# EAGLE design XOrduino2 (EAGLE 6.2)
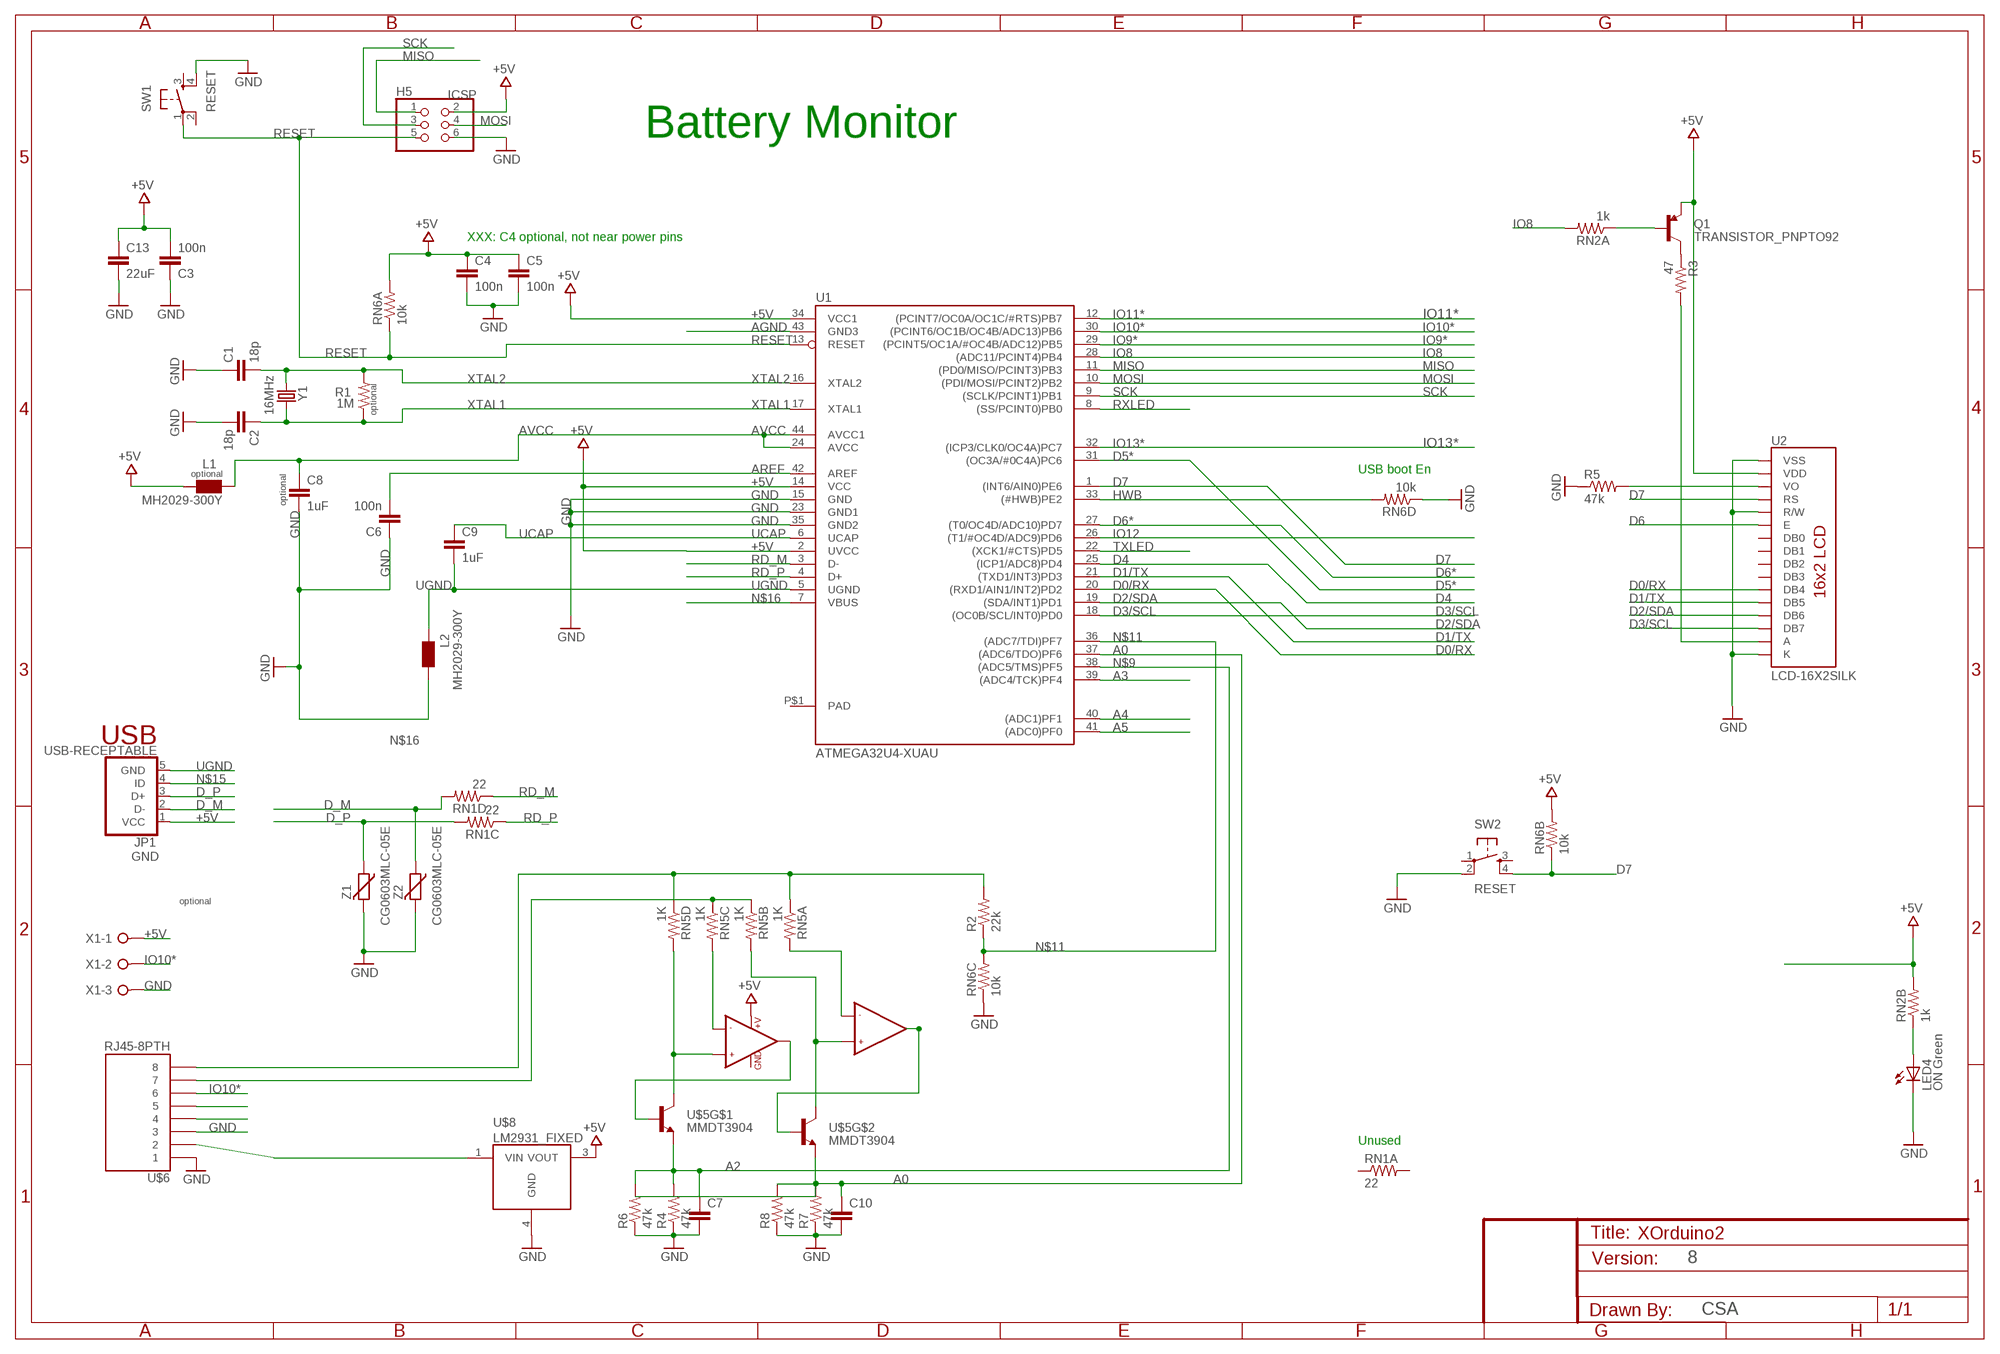
[diagram p0: schematic, sheet 1]

## Parts
C1  18p  CAP0805  [0805]
C2  18p  CAP0805  [0805]
C3  100n  CAP0805  [0805]
C4  100n  CAP0805  [0805]
C5  100n  CAP0805  [0805]
C6  100n  CAP0805  [0805]
C7  CAP0805  [0805]
C8  1uF  CAP0805  [0805]
C9  1uF  CAP0805  [0805]
C10  CAP0805  [0805]
C13  22uF  CAP1206  [1206]
H5  ICSP  PINHD-2X3  [2X03]
JP1  USB-RECEPTABLE  [FCI-10103594-0001LF]
L1  MH2029-300Y  WE-CBF_0805  [0805]
L2  MH2029-300Y  WE-CBF_0805  [0805]
LED4  ON Green  LED0805  [LED0805]
Q1  TRANSISTOR_PNPTO92  [TO-92]
R1  1M  RESISTOR0805-RES  [0805]
R2  22k  RESISTOR0805-RES  [0805]
R3  47  R-US_0207/15  [0207/15]
R4  47k  RESISTOR0805-RES  [0805]
R5  47k  RESISTOR0805-RES  [0805]
R6  47k  RESISTOR0805-RES  [0805]
R7  47k  RESISTOR0805-RES  [0805]
R8  47k  RESISTOR0805-RES  [0805]
RN1  22  RESISTOR-ARRAYCRA06S  [CRA06S]
RN2  1k  RESISTOR-ARRAYCRA06S  [CRA06S]
RN5  1K  RESISTOR-ARRAYCRA06S  [CRA06S]
RN6  10k  RESISTOR-ARRAYCRA06S  [CRA06S]
SW1  RESET  TAC_SWITCHPTH  [TACTILE-PTH]
SW2  RESET  TAC_SWITCHPTH  [TACTILE-PTH]
U1  ATMEGA32U4-XUAU  [TQFP44-PAD]
U2  LCD-16X2SILK  [LCD-16X2]
U$2  LMV358  [SO08]
U$5  MMDT3904  [SOT363]
U$6  RJ45-8PTH  [RJ45-8]
U$8  LM2931_FIXED  [DPAK]
X1  W237-03P  [W237-133]
Y1  16MHz  CRYSTALHC49US  [HC49US]
Z1  CG0603MLC-05E  VARISTORCN0603  [CT/CN0603]
Z2  CG0603MLC-05E  VARISTORCN0603  [CT/CN0603]

## Nets
+5V [power]: C3.2 C4.1 C5.1 C13.1 H5.2 JP1.1(VCC) L1.1 Q1.1(E) RN2.7 RN6.7 RN6.8 U1.2(UVCC) U1.14(VCC) U1.34(VCC1) U2.2(VDD) U$2.8(+V) U$8.3(VOUT) X1.1
A0: C10.1 R7.2 R8.2 U1.37((ADC6/TDO)PF6) U$5.1(E)
A2: C7.1 R4.2 R6.2 U$5.4(E)
A3: U1.39((ADC4/TCK)PF4)
A4: U1.40((ADC1)PF1)
A5: U1.41((ADC0)PF0)
AGND: U1.43(GND3)
AREF [aref]: C6.2 U1.42(AREF)
AVCC: C8.1 L1.2 U1.24(AVCC) U1.44(AVCC1)
D0/RX: U1.20((RXD1/AIN1/INT2)PD2) U2.11(DB4)
D1/TX: U1.21((TXD1/INT3)PD3) U2.12(DB5)
D2/SDA: U1.19((SDA/INT1)PD1) U2.13(DB6)
D3/SCL: U1.18((OC0B/SCL/INT0)PD0) U2.14(DB7)
D4: U1.25((ICP1/ADC8)PD4)
D5*: U1.31((OC3A/#0C4A)PC6)
D6: U2.6(E)
D6*: U1.27((T0/OC4D/ADC10)PD7)
D7: RN6.2 SW2.4 U1.1((INT6/AIN0)PE6) U2.4(RS)
D_M: JP1.2(D-) RN1.5 Z2.1
D_P: JP1.3(D+) RN1.6 Z1.1
GND [gnd]: C1.1 C2.2 C3.1 C4.2 C5.2 C6.1 C7.2 C8.2 C10.2 C13.2 H5.6 L2.2 LED4.C R4.1 R5.1 R6.1 R7.1 R8.1 RN6.3 RN6.4 SW1.4 SW2.2 U1.15(GND) U1.23(GND1) U1.35(GND2) U2.1(VSS) U2.5(R/W) U2.16(K) U$6.1 U$6.3 U$6.4 U$8.4(GND) X1.3 Z1.2 Z2.2
HWB: RN6.5 U1.33((#HWB)PE2)
IO8: RN2.8 U1.28((ADC11/PCINT4)PB4)
IO9*: U1.29((PCINT5/OC1A/#OC4B/ADC12)PB5)
IO10*: U1.30((PCINT6/OC1B/OC4B/ADC13)PB6) U$6.6 X1.2
IO11*: U1.12((PCINT7/OC0A/OC1C/#RTS)PB7)
IO12: U1.26((T1/#OC4D/ADC9)PD6)
IO13*: U1.32((ICP3/CLK0/OC4A)PC7)
LED4_ANODE: LED4.A RN2.2
MISO: H5.1 U1.11((PD0/MISO/PCINT3)PB3)
MOSI: H5.4 U1.10((PDI/MOSI/PCINT2)PB2)
N$1: RN5.5 U$2.3(+IN1) U$5.3(C)
N$2: RN5.8 U$2.6(-IN2)
N$3: RN5.7 U$2.5(+IN2) U$5.6(C)
N$4: U$2.1(OUT1) U$5.5(B)
N$5: U$2.7(OUT2) U$5.2(B)
N$6: RN5.6 U$2.2(-IN1)
N$7: R2.2 RN5.1 RN5.4 U$6.8
N$8: RN5.2 RN5.3 U$6.7
N$9: U1.38((ADC5/TMS)PF5)
N$10: Q1.3(C) R3.1
N$11: R2.1 RN6.6 U1.36((ADC7/TDI)PF7)
N$12: R5.2 U2.3(VO)
N$13: R3.2 U2.15(A)
N$15: JP1.4(ID)
N$16 [power]: U1.7(VBUS)
N$18: U$6.2 U$8.1(VIN)
N$19: Q1.2(B) RN2.1
N$20: U$6.5
RD_M: RN1.4 U1.3(D-)
RD_P: RN1.3 U1.4(D+)
RESET: H5.5 RN6.1 SW1.1 U1.13(RESET)
RXLED: U1.8((SS/PCINT0)PB0)
SCK: H5.3 U1.9((SCLK/PCINT1)PB1)
TXLED: U1.22((XCK1/#CTS)PD5)
UCAP: C9.1 U1.6(UCAP)
UGND [gnd]: C9.2 JP1.5(GND) L2.1 U1.5(UGND)
XTAL1: C2.1 R1.1 U1.17(XTAL1) Y1.2
XTAL2: C1.2 R1.2 U1.16(XTAL2) Y1.1
Unconnected: RN1.1 RN1.2 RN1.7 RN1.8 RN2.3 RN2.4 RN2.5 RN2.6 SW1.2 SW1.3 SW2.1 SW2.3 U2.7(DB0) U2.8(DB1) U2.9(DB2) U2.10(DB3)

## Notes on the sheet
- Battery Monitor
- XXX: C4 optional, not near power pins
- optional
- USB boot En
- optional
- optional
- USB
- optional
- Unused
- 8
- CSA

## Power pins joined to a net without a drawn wire
GND: U$2.4(GND)
PAD: U1.P$1(PAD)

## Library data of the parts
C1-C6 C8 C9 C13 = SparkFun-Passives:CAP: Capacitor Standard 0603 ceramic capacitor, and 0.1" leaded capacitor.
C7 C10 = SparkFun-Capacitors:CAP: Capacitor Standard 0603 ceramic capacitor, and 0.1" leaded capacitor.
H5 = SmartPrj:PINHD-2X3: PIN HEADER
JP1 = daspilker:USB-RECEPTABLE: USB Receptable
L1 L2 = wuerth-elektronik:WE-CBF: SMD EMI Suppression Ferrite Beads - excellent anti-EMI properties - low DCR - impedances till 3000 ohms - rated current up to 6 A
LED4 = xorduino:LED
Q1 = SparkFun-DiscreteSemi:TRANSISTOR_PNP: Generic PNP BJT. Double check pinouts against datasheets- not all devices are the same!
R1 R2 R4-R8 = SparkFun-Passives:RESISTOR: Resistor Basic schematic elements and footprints for 0603, 1206, and PTH resistors.
R3 = adafruit:R-US_: RESISTOR, American symbol
RN1 RN2 RN5 RN6 = xorduino:RESISTOR-ARRAY
SW1 SW2 = SparkFun-Electromechanical:TAC_SWITCH: Momentary Switch Button commonly used for reset or general input. Spark Fun Electronics SKU : COM-00097
U1 = SmartPrj:ATMEGA32U4-XU
U2 = SparkFun-Displays:LCD-16X2: Standard text-only 16x2 parallel input LCD
U$2 = SparkFun-AnalogIC:LMV358: Jellybean rail-to-rail output op-amp
U$5 = SparkFun-DiscreteSemi:MMDT3904: Dual NPN transistor
U$6 = SparkFun-Connectors:RJ45-8: RJ45 Jack Simple RJ45, 8-pin connection - connector for common Cat5, Cat5e, and Cat6 Ethernet cables. Footprint not yet proven in production. Connector sku is PRT-00643; Breakout PCB sku is BOB-00716.
U$8 = SparkFun-PowerIC:LM2931_FIXED: LDO regulator with reverse battery protection- very durable!
X1 = con-wago-508:W237-03P: WAGO SREW CLAMP; OC_FARNELL: unknown; OC_NEWARK: unknown
Y1 = SparkFun-FreqCtrl:CRYSTAL: Various standard crystals. Proven footprints. Spark Fun Electronics SKU : COM-00534
Z1 Z2 = varistor:VARISTOR: VARISTOR

## Net classes
0 default: width 0.203 mm, drill 0.406 mm, clearance 0.203 mm
1 power: width 0.203 mm, drill 0.406 mm, clearance 0.203 mm
2 gnd: width 0.203 mm, drill 0.406 mm, clearance 0.203 mm
3 usbvcc: width 0.203 mm, drill 0.406 mm, clearance 0.203 mm
4 aref: width 0.203 mm, drill 0.406 mm, clearance 0.203 mm

## Board
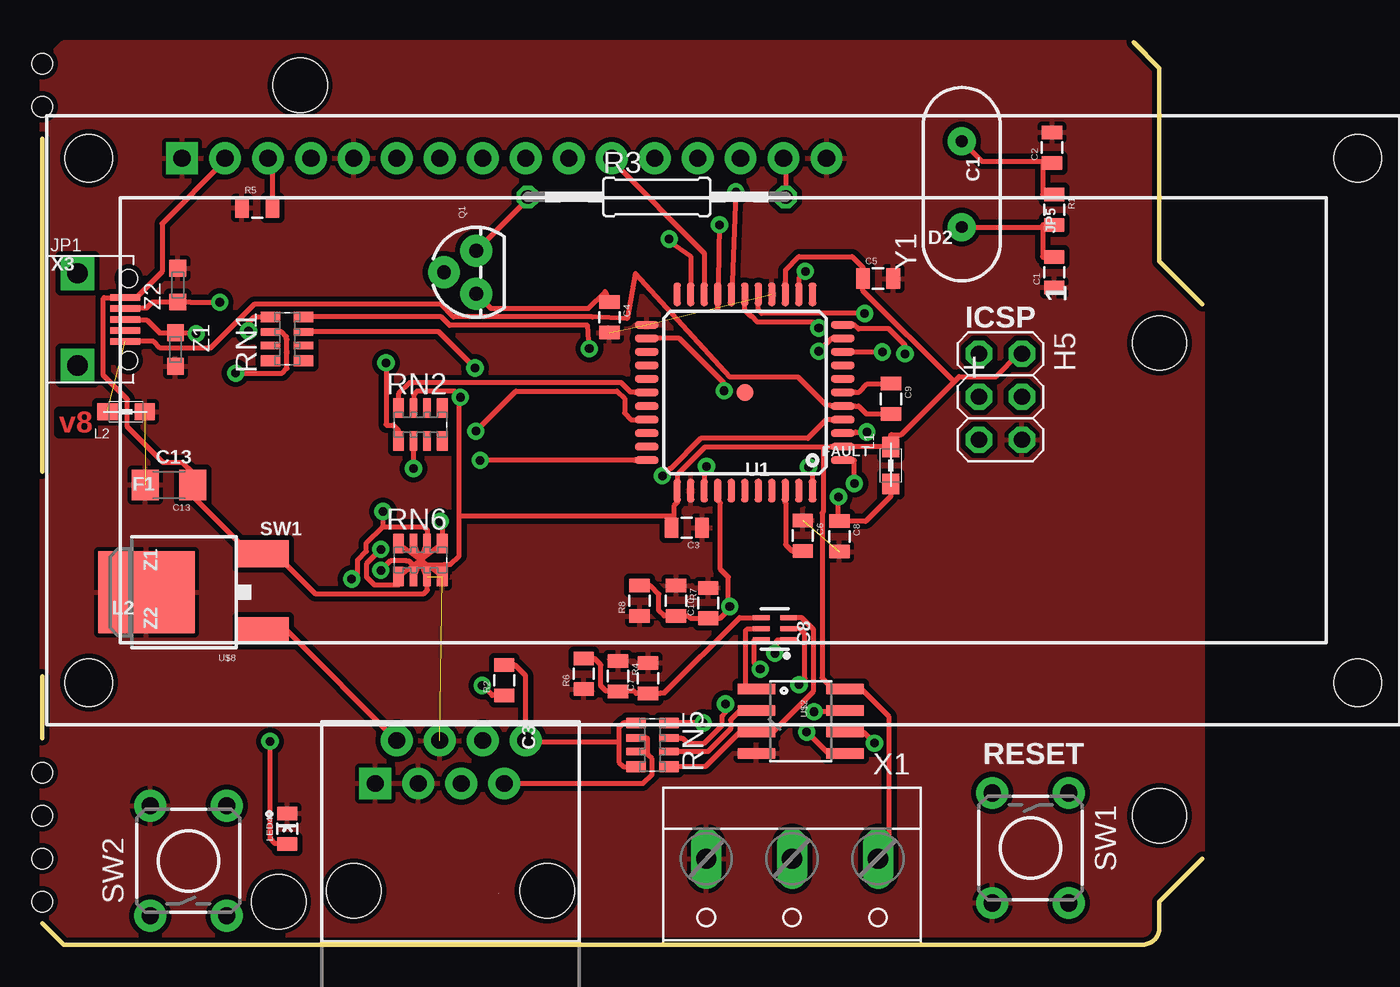
[diagram p1: board, top side]
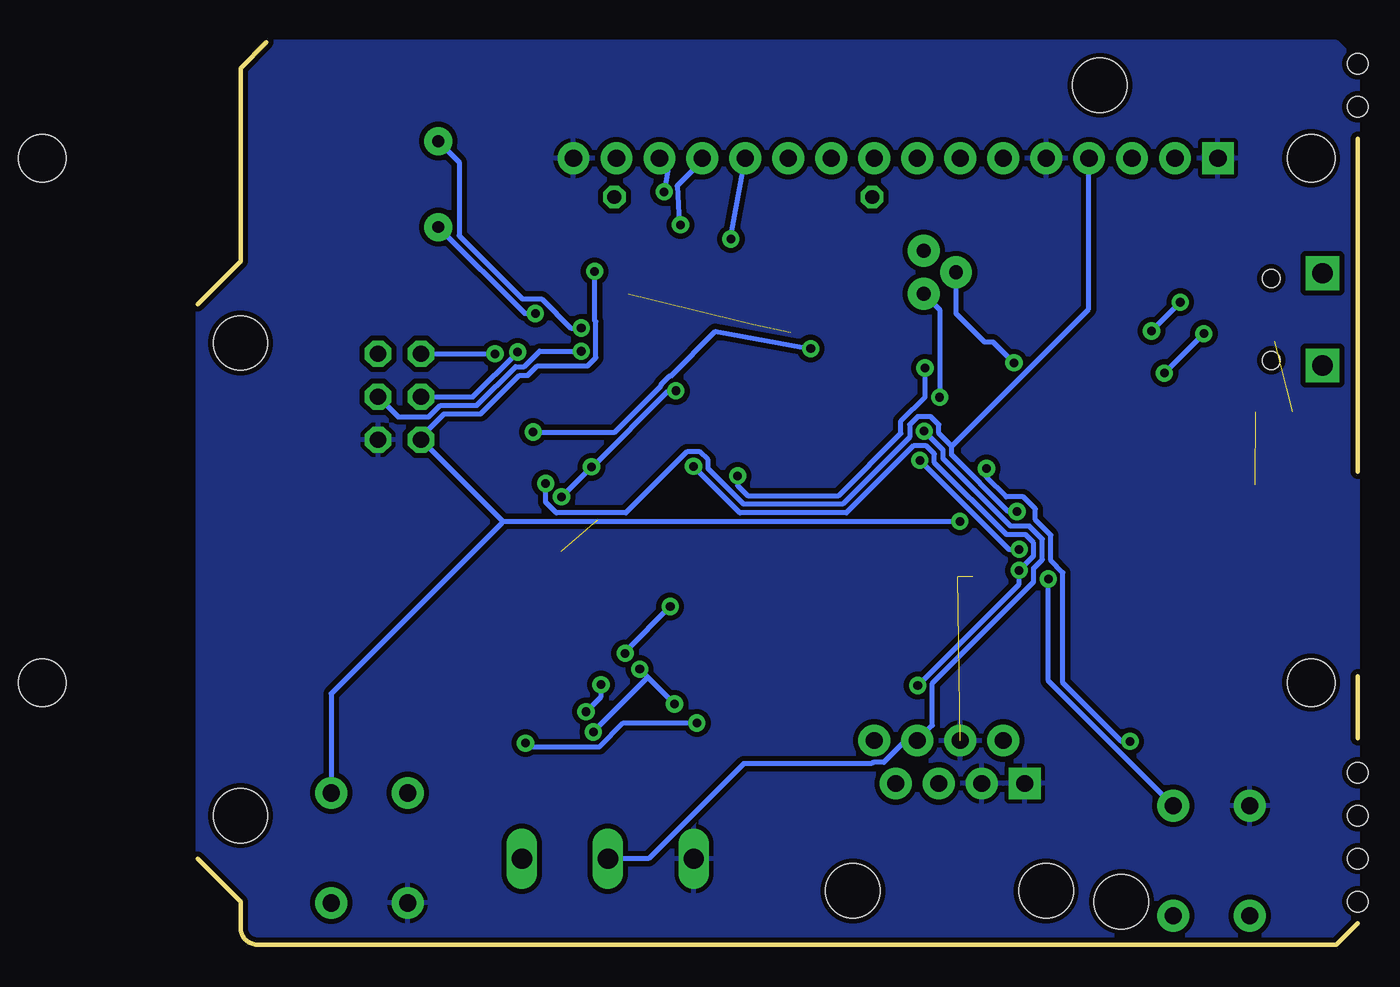
[diagram p2: board, bottom side, seen from below]

Size 68.58 x 53.34 mm. Coordinates in mm from the lower left corner, seen from the top.
Outline: 64.52,53.34 66.04,51.82 66.04,40.39 68.58,37.85
Outline: 68.58,5.08 66.04,2.54 66.04,1 arc-90 65.04,0 1.27,0 0,1.27
Outline: 0,12.19 0,15.88
Outline: 0,27.94 0,47.62
Copper layers (1*2+15*16): gnd$top 0.035mm / dielectric 0.2mm / layer 2 0.035mm / dielectric 0.15mm / layer 15 0.035mm / dielectric 0.2mm / gnd$bot 0.035mm
Design rules: minimum track width 12mil, minimum drill 20mil, track to track 8mil, track to pad 8mil, pad to pad 8mil, via to via 8mil, smd to smd 8mil, copper to edge 12mil, drill to drill 8mil, minimum pad ring 10mil, minimum via ring 10mil, stop-mask expansion 4mil, vias tented up to drill 25mil, thermal gap 10mil
Holes 3.2 mm at 66.04,35.56 66.04,7.62 15.24,50.8 13.97,2.54
Holes 1.2 mm at 0,10.16 0,7.62 0,5.08 0,2.54 0,52.07 0,49.53

### Footprints (pad centres in the part's own frame; a part is rotated, then mirrored left to right if it is on the bottom)
0805 = smd 0.8 x 1.2: 1 -0.9,0; 2 0.9,0
1206 = smd 1.6 x 1.8: 1 -1.4,0; 2 1.4,0
2X03 = drill 0.95 pad 1.55 octagon: 1 -2.54,-1.27; 2 -2.54,1.27; 3 0,-1.27; 4 0,1.27; 5 2.54,-1.27; 6 2.54,1.27
FCI-10103594-0001LF = smd 0.4 x 1.75: 1 -1.3,4.525; 2 -0.65,4.525; 3 0,4.525; 4 0.65,4.525; 5 1.3,4.525 | drill 1.2 pad 2 square: P$3 -2.725,1.7; P$4 2.725,1.7 | hole 1.05: -2.425,4.73; 2.425,4.73
0805' = smd 1.2 x 1: 1 -1.1,0; 2 1.1,0
LED0805 = smd 0.8 x 1.2: A -0.9,0; C 0.9,0
TO-92 = drill 0.813 pad 1.88: 1 -1.27,0; 2 0,1.905; 3 1.27,0
0207/15 = drill 0.813 octagon: 1 -7.62,0; 2 7.62,0
CRA06S = smd 0.63 x 1.15: 1 -1.295,-0.975; 4 1.295,-0.975; 5 1.295,0.975; 8 -1.295,0.975 | smd 0.44 x 1.15: 2 -0.4,-0.975; 3 0.4,-0.975; 6 0.4,0.975; 7 -0.4,0.975
TACTILE-PTH = drill 1.016 pad 1.88: 1 -3.251,2.261; 2 3.251,2.261; 3 -3.251,-2.261; 4 3.251,-2.261
TQFP44-PAD = smd 1.4 x 0.45: 1 -5.8,4; 2 -5.8,3.2; 3 -5.8,2.4; 4 -5.8,1.6; 5 -5.8,0.8; 6 -5.8,0; 7 -5.8,-0.8; 8 -5.8,-1.6; 9 -5.8,-2.4; 10 -5.8,-3.2; 11 -5.8,-4; 23 5.8,-4; 24 5.8,-3.2; 25 5.8,-2.4; 26 5.8,-1.6; 27 5.8,-0.8; 28 5.8,0; 29 5.8,0.8; 30 5.8,1.6; 31 5.8,2.4; 32 5.8,3.2; 33 5.8,4 | smd 0.45 x 1.4: 12 -4,-5.8; 13 -3.2,-5.8; 14 -2.4,-5.8; 15 -1.6,-5.8; 16 -0.8,-5.8; 17 0,-5.8; 18 0.8,-5.8; 19 1.6,-5.8; 20 2.4,-5.8; 21 3.2,-5.8; 22 4,-5.8; 34 4,5.8; 35 3.2,5.8; 36 2.4,5.8; 37 1.6,5.8; 38 0.8,5.8; 39 0,5.8; 40 -0.8,5.8; 41 -1.6,5.8; 42 -2.4,5.8; 43 -3.2,5.8; 44 -4,5.8 | smd 1 x 1: P$1 0,0
LCD-16X2 = drill 1.016 pad 1.88 square: 1 -32,15.5 | drill 1.016 pad 1.88: 2 -29.46,15.5; 3 -26.92,15.5; 4 -24.38,15.5; 5 -21.84,15.5; 6 -19.3,15.5; 7 -16.76,15.5; 8 -14.22,15.5; 9 -11.68,15.5; 10 -9.14,15.5; 11 -6.6,15.5; 12 -4.06,15.5; 13 -1.52,15.5; 14 1.02,15.5; 15 3.56,15.5; 16 6.1,15.5 | hole 2.8: -37.5,15.5; -37.5,-15.5; 37.5,15.5; 37.5,-15.5
SO08 = smd 0.61 x 2.21: 1 -1.905,-2.616; 2 -0.635,-2.616; 3 0.635,-2.616; 4 1.905,-2.616; 5 1.905,2.616; 6 0.635,2.616; 7 -0.635,2.616; 8 -1.905,2.616
SOT363 = smd 0.3 x 0.99: 1 -0.65,-0.8; 2 0,-0.8; 3 0.65,-0.8; 4 0.65,0.81; 5 0,0.81; 6 -0.65,0.81
RJ45-8 = drill 1 pad 1.88 square: 1 -4.445,6.35 | drill 1 pad 1.88: 2 -3.175,8.89; 3 -1.905,6.35; 4 -0.635,8.89; 5 0.635,6.35; 6 1.905,8.89; 7 3.175,6.35; 8 4.445,8.89 | hole 3.2: -5.715,0; 5.715,0
DPAK = smd 1.6 x 3: 1 -2.28,-5.31; 3 2.28,-5.31 | smd 4.826 x 5.715: 4 0,1.588
W237-133 = drill 1.194 long: 1 -5.08,-0.635; 2 0,-0.635; 3 5.08,-0.635
HC49US = drill 0.7 pad 1.651: 1 -2.54,0; 2 2.54,0
CT/CN0603 = smd 1 x 1: 1 -1,0; 2 1,0

### Placement (x,y rotation side)
C1  59.82,39.75 90 top
C2  59.69,47.12 90 top
C3  38.1,24.64 180 top
C4  33.53,37.08 270 top
C5  49.4,39.37 0 top
C6  44.96,24.18 270 top
C7  35.81,15.75 90 top
C8  47.12,24.13 270 top
C9  50.17,32.26 270 top
C10  39.37,20.19 90 top
C13  7.49,27.18 180 top
H5  56.64,32.38 270 top
JP1  0.38,36.96 270 top
L1  MH2029-300Y  [0805']  50.17,28.32 270 top
L2  MH2029-300Y  [0805']  4.95,31.5 0 top
LED4  14.48,6.86 90 top
Q1  25.65,39.75 90 top
R1  59.82,43.43 270 top
R2  27.31,15.62 90 top
R3  36.32,44.2 0 top
R4  34.04,15.88 270 top
R5  12.7,43.56 0 top
R6  32,16 90 top
R7  37.47,20.32 270 top
R8  35.31,20.32 90 top
RN1  14.48,35.81 90 top
RN2  22.35,30.73 0 top
RN5  36.07,11.81 270 top
RN6  22.35,22.73 0 top
SW1  58.42,5.71 270 top
SW2  8.64,4.95 90 top
U1  41.53,32.64 180 top
U2  40.26,30.99 0 top
U$2  44.83,13.21 270 top
U$5  43.31,18.67 90 top
U$6  24.13,3.17 0 top
U$8  7.75,20.83 90 top
X1  44.32,4.45 180 top
Y1  54.36,44.96 90 top
Z1  7.87,35.18 270 top
Z2  8,38.99 90 top

### Tracks (layer width: path | path; a pad name or v marks a point on that pad's centre or on a via)
+5V  (via drill 0.51)
  gnd$top 0.305: RN2.7 21.95,31.73 21.95,32.51 22.15,32.72 24.36,32.72 v24.71,32.36 24.64,32.23 24.64,25.32 | Q1.1 26.52,37.62 32.28,37.62 33.27,38.61 C4.1 | U2.2 10.8,46.33 7.09,42.62 7.09,39.78 5.56,38.25 4.93,38.25 JP1.1 4.75,38.25 3.66,38.25 3.61,38.2 3.61,33.66 5.03,32.23 5.03,30.61 7.14,28.5 8.28,28.5 8.89,27.89 8.89,27.3 C13.1 8.89,26.52 12.27,23.14 12.34,23.14 12.37,23.11 12.9,23.11 U$8.3 13.08,23.11 13.77,23.11 16.13,20.75 22.56,20.75 22.76,20.95 22.76,21.61 RN6.7 22.76,21.77 22.76,22.4 22.78,22.43 23.62,22.43 23.65,22.4 | 23.65,22.4 23.65,21.77 RN6.8 | 24.64,25.32 24.64,22.99 24.13,22.48 23.77,22.48 23.65,22.4 | X1.1 50.06,5.74 50.06,13.46 48.41,15.11 U$2.8 46.74,15.11 46.1,15.75 46.1,25.53 46.18,25.6 46.18,29.41 | U1.14 43.92,38.46 43.92,39.14 43.94,39.17 43.94,39.88 44.73,40.66 47.88,40.66 48.51,40.03 48.51,39.37 C5.1 48.51,39.24 48.51,38.66 53.9,33.27 | H5.2 57.73,34.92 56.39,33.58 54.2,33.58 53.9,33.27 | 53.9,33.27 50.78,30.15 50.19,30.15 50.17,30.12 L1.1 50.04,29.44 47.35,29.44 U1.2 47.19,29.44 46.63,29.44 46.61,29.41 46.18,29.41 | 46.18,29.41 39.17,29.41 37.54,27.79 37.54,26.98 U1.34 37.54,26.82 37.54,26.14 37.34,25.93 37.34,25.27 C3.2 37.19,25.32 24.64,25.32
  gnd$bot 0.305: v24.71,32.36 24.71,37.54 Q1.1
A0  (via drill 0.51)
  gnd$top 0.305: v43.31,17.22 43.41,17.32 43.41,17.96 43.46,18.01 44.09,18.01 U$5.1 | R8.2 35.31,21.21 35.97,21.21 36.45,20.73 36.45,19.74 36.75,19.43 37.34,19.43 R7.2 37.47,19.43 38.18,19.43 38.3,19.3 39.37,19.3 C10.1 39.5,19.3 40.08,19.3 40.64,19.86 v40.64,19.99 40.56,20.12 40.56,21.72 40.08,22.2 40.08,26.11 39.93,26.26 39.93,26.82 U1.37
  gnd$bot 0.305: v43.31,17.22 43.31,17.32 v40.64,19.99
A2
  gnd$top 0.305: R6.2 32.66,16.89 33.02,16.54 33.02,15.29 33.33,14.99 34.04,14.99 R4.2 34.16,14.99 34.98,14.99 35.1,14.86 35.69,14.86 C7.1 36.53,14.86 36.55,14.88 36.78,14.88 41.22,19.33 U$5.4
AREF
  gnd$top 0.305: C6.2 44.96,23.29 44.3,23.29 43.94,23.65 43.94,26.11 43.92,26.14 43.92,26.82 U1.42
AVCC  (via drill 0.51)
  gnd$top 0.305: L1.2 50.17,26.52 48.67,25.02 47.12,25.02 C8.1 47.07,25.17 v47.07,26.47 | v45.29,28.25 45.52,28.02 45.52,26.85 U1.44 | v40.31,32.74 40.31,33.17 37.64,35.84 U1.24
  gnd$bot 0.305: v47.07,26.47 v45.29,28.25 45.16,28.32 40.74,32.74 v40.31,32.74
D0/RX
  gnd$top 0.305: U1.20 39.14,38.46 39.14,40.87 33.68,46.33 33.68,46.48 U2.11
D1/TX  (via drill 0.51)
  gnd$top 0.305: v37.06,41.71 37.06,41.58 38.33,40.69 U1.21
  gnd$bot 0.305: v37.06,41.71 37.21,41.58 37.11,41.68 36.22,46.48 U2.12
D2/SDA  (via drill 0.51)
  gnd$top 0.305: v40.03,42.55 39.93,37.49 U1.19
  gnd$bot 0.305: v40.03,42.55 40.11,42.62 40.23,44.86 38.76,46.33 38.76,46.48 U2.13
D3/SCL  (via drill 0.51)
  gnd$top 0.305: v41,44.5 40.74,38.43 U1.18
  gnd$bot 0.305: v41,44.5 40.74,45.95 U2.14
D7  (via drill 0.51)
  gnd$top 0.305: 20.14,24.71 20.12,24.71 19.15,23.75 19.15,23.24 18.64,22.73 18.64,21.97 v18.29,21.61 | 20.14,24.71 22.56,24.71 22.76,24.51 22.76,23.72 RN6.2 | v48.01,27.25 48.01,28.63 47.98,28.65 47.35,28.65 U1.1 | 20.14,24.71 v20.14,25.6
  gnd$bot 0.305: v18.29,21.61 18.29,15.6 SW2.4 | v48.01,27.25 48.01,26.16 47.37,25.53 43.26,25.53 39.65,29.13 38.89,29.13 38.41,28.65 38.41,28.14 36.3,26.04 30.46,26.04 26.49,30 26.49,30.73 26.01,31.22 25.25,31.22 24.77,30.73 24.77,30.23 24,29.46 | 24,29.46 24,28.96 20.65,25.6 v20.14,25.6 | 24,29.46 15.9,37.57 15.9,46.48 U2.4
D_M  (via drill 0.51)
  gnd$top 0.305: JP1.2 4.93,37.62 5.61,37.62 5.64,37.64 6.17,37.64 6.53,38 Z2.1 8.13,38 8.71,38 8.74,37.97 v10.49,37.97 | v12.19,36.27 12.19,36.78 12.52,37.11 13.49,37.11 RN1.5
  gnd$bot 0.305: v10.49,37.97 v12.19,36.27
D_P  (via drill 0.51)
  gnd$top 0.305: JP1.3 5.61,36.96 5.64,36.93 6.17,36.93 6.93,36.17 Z1.1 8,36.17 8.59,36.17 8.64,36.12 v9.09,36.12 | v11.43,33.78 14.17,33.78 14.45,34.06 14.45,34.98 14.43,35 14.43,35.03 14.45,35.05 14.45,35.76 14.43,35.79 14.43,35.94 14.15,36.22 13.51,36.22 RN1.6
  gnd$bot 0.305: v9.09,36.12 v11.43,33.78
GND  (6 unrouted)
  gnd$top 0.305: U1.23 35.74,36.65 U1.23
  pour gnd$bot (isolate 0.305): 0,1.27 0,52.07 1.27,53.34 64.77,53.34 66.04,52.07 66.04,40.64 68.58,38.1 68.58,5.08 66.04,2.54 66.04,1.27 64.77,0 2.54,0
  pour gnd$top (isolate 0.305): 0,1.27 0,52.07 1.27,53.34 64.77,53.34 66.04,52.07 66.04,40.64 68.58,38.1 68.58,5.08 66.04,2.54 66.04,1.27 64.77,0 2.54,0
HWB  (via drill 0.51)
  gnd$top 0.305: v20.02,23.37 19.15,22.5 19.15,21.74 19.63,21.26 21.06,21.26 21.06,21.74 RN6.5 | v25.88,28.63 35,28.63 35.03,28.65 35.71,28.65 U1.33
  gnd$bot 0.305: v20.02,23.37 20.63,23.37 v25.88,28.63
IO8
  gnd$top 0.305: U1.28 35.03,32.64 35,32.66 34.77,32.66 34.21,33.22 21.72,33.22 21.06,32.56 21.06,31.73 RN2.8
IO10*  (via drill 0.51)
  gnd$top 0.305: v25.63,30.35 27.99,32.72 33.98,32.72 34.42,32.28 34.42,31.42 34.8,31.04 35.71,31.04 U1.30
  gnd$bot 0.305: v25.63,30.35 24.51,29.23 24.51,28.73 20.52,24.74 19.41,24.74 18.64,23.98 18.64,22.76 19.15,22.25 19.15,21.44 25.15,15.44 25.15,12.95 U$6.6 26.16,11.99 26.8,11.99 28.02,10.77 28.65,10.77 28.73,10.69 36.3,10.69 41.91,5.08 X1.2
LED4_ANODE  (via drill 0.51)
  gnd$top 0.305: v21.95,28.14 21.95,29.74 RN2.2 | v13.46,12.01 13.46,6.27 13.77,5.97 LED4.A
  gnd$bot 0.305: v21.95,28.14 21.95,27.64 20.78,26.47 19.76,26.47 19.05,25.76 19.05,25.12 18.14,24.21 18.14,22.71 17.42,22 17.42,15.47 13.97,12.01 v13.46,12.01
MISO  (via drill 0.51)
  gnd$top 0.305: v51,34.92 51,35.43 50.04,36.4 48.23,36.4 48.01,36.63 47.35,36.63 U1.11
  gnd$bot 0.305: H5.1 v51,34.92
MOSI  (via drill 0.51)
  gnd$top 0.305: v45.9,35.08 46.66,35.84 U1.10
  gnd$bot 0.305: v45.9,35.08 48.36,35.08 49.28,34.16 49.78,34.16 52.07,31.88 54.23,31.88 54.91,31.19 56.72,31.19 H5.4
N$1
  gnd$top 0.305: U$5.3 44.88,19.33 45.59,18.62 45.59,14.99 43.2,12.6 42.95,12.6 42.93,12.57 U$2.3 41.5,12.57 41.48,12.55 41.22,12.55 39.19,10.52 37.06,10.52 RN5.5
N$2  (via drill 0.51)
  gnd$top 0.305: v39.06,13.11 37.06,13.11 RN5.8 | v49.2,11.91 48.56,12.55 48.18,12.55 48.16,12.57 U$2.6
  gnd$bot 0.305: v39.06,13.11 43.41,13.11 44.81,11.71 49,11.71 v49.2,11.91
N$3  (via drill 0.51)
  gnd$top 0.305: v42.44,16.28 42.09,16.64 42.09,18.01 U$5.6 | v40.39,14.22 40.39,13.72 40.18,13.51 40.18,12.98 39.12,11.91 38.15,11.91 37.87,12.19 37.77,12.19 37.74,12.22 37.06,12.22 RN5.7 | U$2.5 46.46,11.3 v45.19,12.57
  gnd$bot 0.305: v40.39,14.22 41.96,15.8 | 41.96,15.8 v42.44,16.28 | 41.96,15.8 v45.19,12.57
N$4
  gnd$top 0.305: U$5.5 41.68,18.67 41.58,18.57 41.58,15.14 41.61,15.11 U$2.1
N$5  (via drill 0.51)
  gnd$top 0.305: U$5.2 44.81,18.67 45.08,18.39 45.08,15.72 v44.73,15.37 | v45.62,13.77 46.66,13.77 46.74,13.84 U$2.7
  gnd$bot 0.305: v44.73,15.37 44.73,14.66 v45.62,13.77
N$6
  gnd$top 0.305: U$2.2 41.5,13.84 41.48,13.82 41.22,13.82 40.69,13.28 40.69,12.75 39.34,11.4 37.06,11.4 RN5.6
N$7
  gnd$top 0.305: 34.09,11.99 34.09,12.83 34.37,13.11 35.08,13.11 RN5.1 | 34.09,11.99 34.09,10.79 34.37,10.52 35.08,10.52 RN5.4 | R2.2 27.96,16.51 28.57,15.9 U$6.8 28.7,11.99 34.09,11.99
N$8
  gnd$top 0.305: 35.74,11.4 35.1,11.4 RN5.3 | 35.74,11.4 35.76,11.43 35.76,12.19 35.74,12.22 35.1,12.22 RN5.2 | U$6.7 35.51,9.53 36.04,10.06 36.04,10.97 35.81,11.2 35.81,11.28 35.74,11.4
N$10
  gnd$top 0.305: R3.1 28.7,44.07 Q1.3
N$11  (via drill 0.51)
  gnd$top 0.305: v20.02,22.12 20.6,22.71 21.51,22.71 21.54,22.68 21.67,22.68 21.95,22.4 21.95,21.77 RN6.6 | v26.01,15.32 26.59,14.73 27.31,14.73 R2.1 | v39.27,28.27 39.14,28.14 39.14,26.85 U1.36
  gnd$bot 0.305: v26.01,15.32 20.02,21.31 v20.02,22.12 19.15,22.99 19.15,23.75 19.63,24.23 20.75,24.23 25.02,28.5 25.02,29.01 25.5,29.49 26.26,29.49 30.23,25.53 36.53,25.53 v39.27,28.27
N$12
  gnd$top 0.305: R5.2 13.59,46.25 13.36,46.48 U2.3
N$13
  gnd$top 0.305: R3.2 43.94,46.38 43.84,46.48 U2.15
N$18
  gnd$top 0.305: U$6.2 14.48,18.54 13.08,18.54 U$8.1
N$19  (via drill 0.51)
  gnd$top 0.305: v20.32,34.39 20.32,30.73 20.35,30.71 20.75,30.71 21.06,30.4 RN2.1
  gnd$bot 0.305: v20.32,34.39 21.57,35.64 22.07,35.64 23.75,37.31 Q1.2
RD_M  (via drill 0.51)
  gnd$top 0.305: v32.33,35.23 32.23,36.6 24.08,36.6 23.57,37.11 15.47,37.11 RN1.4 | v48.74,30.3 48.08,30.3 48.03,30.25 47.35,30.25 U1.3
  gnd$bot 0.305: v32.33,35.23 37.97,36.25 40.61,33.6 40.69,33.6 41.17,33.12 41.17,33.05 43.92,30.3 v48.74,30.3
RD_P  (via drill 0.51)
  gnd$top 0.305: v25.58,34.09 23.44,36.22 15.47,36.22 RN1.3 | v36.65,27.71 37.08,28.14 37.16,28.14 38.94,29.92 45.26,29.92 46.36,31.01 46.61,31.01 46.63,31.04 U1.4
  gnd$bot 0.305: v25.58,34.09 25.58,32.38 27,30.96 27,30.23 30.68,26.54 36.07,26.54 36.65,27.13 v36.65,27.71
RESET  (via drill 0.51)
  gnd$top 0.305: v23.52,25.02 23.65,24.89 23.65,23.72 RN6.1 | v45.11,39.8 44.73,39.42 44.73,38.46 U1.13
  gnd$bot 0.305: 50.55,25.02 v23.52,25.02 | 50.55,25.02 H5.5 55.3,29.97 55.3,30.07 54,31.37 51.84,31.37 49.56,33.66 49.05,33.66 48.49,34.21 45.52,34.21 45.03,34.7 45.03,36.83 45.11,36.91 v45.11,39.8 | SW1.1 60.68,14.83 50.62,24.89 50.55,25.02
SCK  (via drill 0.51)
  gnd$top 0.305: v49.66,35.03 47.35,35.03 U1.9
  gnd$bot 0.305: v49.66,35.03 52.3,32.38 H5.3
UCAP
  gnd$top 0.305: U1.6 48.03,32.64 48.06,32.66 48.28,32.66 48.77,33.15 50.17,33.15 C9.1
UGND  (1 unrouted)
  gnd$top 0.305: C9.2 48.72,31.37 48.26,31.83 48.06,31.83 48.03,31.85 47.35,31.85 U1.5 47.19,31.85 46.63,31.85 46.61,31.88 46.36,31.88 44.68,33.55 40.67,33.55 35.05,39.67 34.57,37.01 32.51,37.11 24.31,37.11 23.57,37.85 12.52,37.85 9.93,35.26 6.98,35.26 6.58,35.66 4.93,35.66 JP1.5
XTAL1  (via drill 0.51)
  gnd$top 0.305: 59.13,46.23 59.13,44.35 59.16,44.32 R1.1 | 59.13,46.23 C2.1 | U1.17 41.53,37.49 41.86,37.16 41.94,37.16 42.29,36.8 45.54,36.8 v45.9,36.45 | Y1.2 55.55,46.3 59,46.3 59.13,46.23
  gnd$bot 0.305: v45.9,36.45 46.51,36.45 48.23,38.18 49.38,38.18 53.11,41.91 53.11,46.25 Y1.2
XTAL2  (via drill 0.51)
  gnd$top 0.305: 59.13,42.42 59.13,42.52 59.16,42.55 59.82,42.55 R1.2 | 59.13,42.42 59.13,40.66 59.16,40.64 C1.2 | v48.62,37.31 42.52,37.31 42.32,37.52 42.32,38.43 U1.16 | Y1.1 59.13,42.42
  gnd$bot 0.305: v48.62,37.31 49.25,37.31 Y1.1

### Text on the board
gnd$top: v8
tPlace: C1 | JP5 | D2 | X3 | 1 | ICSP | + | C13 | FAULT | U1 | F1 | SW1 | Z1 | L2 | Z2 | C8 | C3 | RESET